# Altium schematic sheet ShieldConnections.SchDoc: Connectors for MSP430 Shield
size A4; DocumentNumber: 2; SheetNumber: 2; SheetTotal: 2
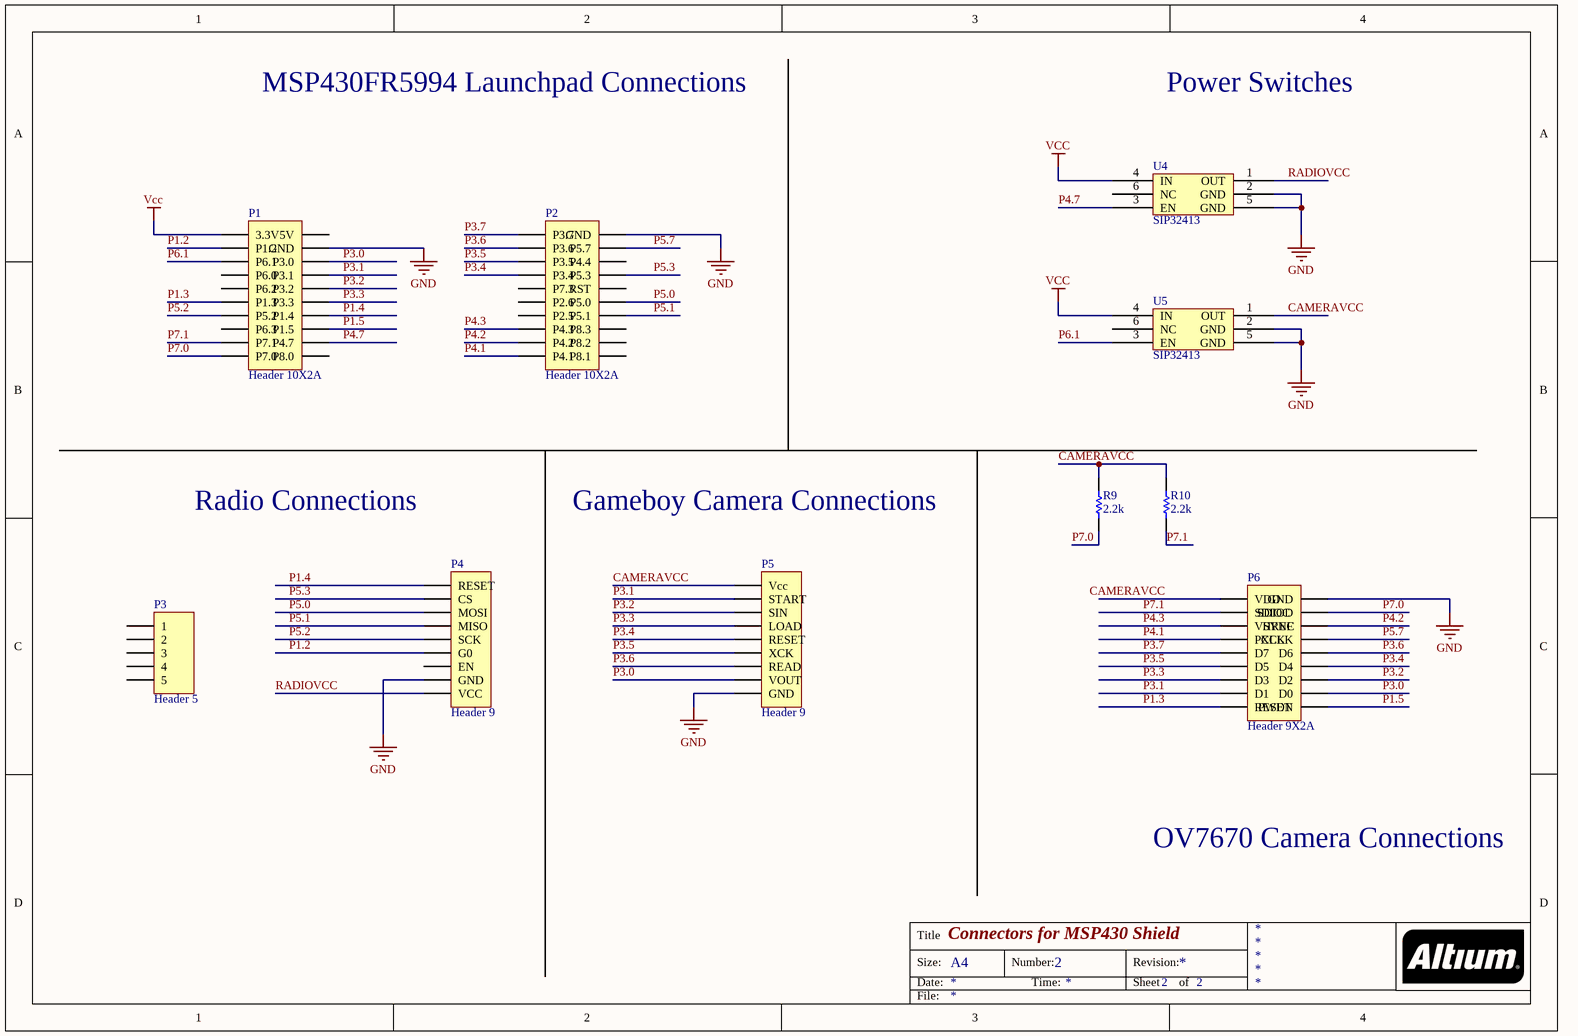
[diagram p0: ShieldConnections.SchDoc]

## Parts
P1  Header 10X2A  [HDR2X10_CEN]
P2  Header 10X2A  [HDR2X10_CEN]
P3  Header 5  [HDR1X5]
P4  Header 9  [HDR1X9]
P5  Header 9  [HDR1X9]
P6  Header 9X2A  [HDR2X9_CEN]
R9  value 2.2k  [0805]  (hidden comment: Res)
R10  value 2.2k  [0805]  (hidden comment: Res)
U4  SIP32413  [SC70-6]
U5  SIP32413  [SC70-6]

## Nets
GND: P1.12(GND) P2.11(GND) P4.8(GND) P5.9(GND) P6.10(GND) U4.2(GND) U4.5(GND) U5.2(GND) U5.5(GND)
Vcc: P1.1(3.3V) U4.4(IN) U5.4(IN)
CAMERAVCC: P5.1(Vcc) P6.1(VDD) R9.2 R10.2 U5.1(OUT)
P1.2: P1.2(P1.2) P4.6(G0)
P1.3: P1.6(P1.3) P6.9(RESET)
P1.4: P1.17(P1.4) P4.1(RESET)
P1.5: P1.18(P1.5) P6.18(PWDN)
P3.0: P1.13(P3.0) P5.8(VOUT) P6.17(D0)
P3.1: P1.14(P3.1) P5.2(START) P6.8(D1)
P3.2: P1.15(P3.2) P5.3(SIN) P6.16(D2)
P3.3: P1.16(P3.3) P5.4(LOAD) P6.7(D3)
P3.4: P2.4(P3.4) P5.5(RESET) P6.15(D4)
P3.5: P2.3(P3.5) P5.6(XCK) P6.6(D5)
P3.6: P2.2(P3.6) P5.7(READ) P6.14(D6)
P3.7: P2.1(P3.7) P6.5(D7)
P4.1: P2.10(P4.1) P6.4(PCLK)
P4.2: P2.9(P4.2) P6.12(HREF)
P4.3: P2.8(P4.3) P6.3(VSYNC)
P4.7: P1.19(P4.7) U4.3(EN)
P5.0: P2.16(P5.0) P4.3(MOSI)
P5.1: P2.17(P5.1) P4.4(MISO)
P5.2: P1.7(P5.2) P4.5(SCK)
P5.3: P2.14(P5.3) P4.2(CS)
P5.7: P2.12(P5.7) P6.13(XCLK)
P6.1: P1.3(P6.1) U5.3(EN)
P7.0: P1.10(P7.0) P6.11(SDIOD) R9.1
P7.1: P1.9(P7.1) P6.2(SDIOC) R10.1
RADIOVCC: P4.9(VCC) U4.1(OUT)

Not connected (* = marked no-connect by the designer): P1 4(P6.0) 5(P6.2) 8(P6.3) 11(5V) 20(P8.0); P2 5(P7.3) 6(P2.6) 7(P2.5) 13(P4.4) 15(RST) 18(P8.3) 19(P8.2) 20(P8.1); P3 1 2 3 4 5; P4 7(EN); U4 6(NC); U5 6(NC)

## Notes on the sheet
- MSP430FR5994 Launchpad Connections
- Power Switches
- Radio Connections
- Gameboy Camera Connections
- OV7670 Camera Connections
- Title
- Size:
- Date:
- A4
- Number:
- Time:
- Revision:
- Sheet
- of
- File:

## Library data of the parts
P1 P2 = Header 10X2A: Header, 10-Pin, Dual row; LatestRevisionDate: 17-Jul-2002; LatestRevisionNote: Re-released for DXP Platform.; Publisher: Altium Limited
P3 = Header 5: Header, 5-Pin; LatestRevisionDate: 17-Jul-2002; LatestRevisionNote: Re-released for DXP Platform.; Publisher: Altium Limited
P4 P5 = Header 9: Header, 9-Pin; LatestRevisionDate: 17-Jul-2002; LatestRevisionNote: Re-released for DXP Platform.; Publisher: Altium Limited
P6 = Header 9X2A: Header, 9-Pin, Dual row; LatestRevisionDate: 17-Jul-2002; LatestRevisionNote: Re-released for DXP Platform.; Publisher: Altium Limited
R9 R10 = Res: Chip Resistor (Surface Mount); Manufacturer: Generic Chip Res (TBD); Manufacturer Part Number: *; Digi-Key Part Number: *; Rating: *; Note: *
U4 U5 = SIP32431